# EAGLE design audioProto_v1 (EAGLE 9.4.2)
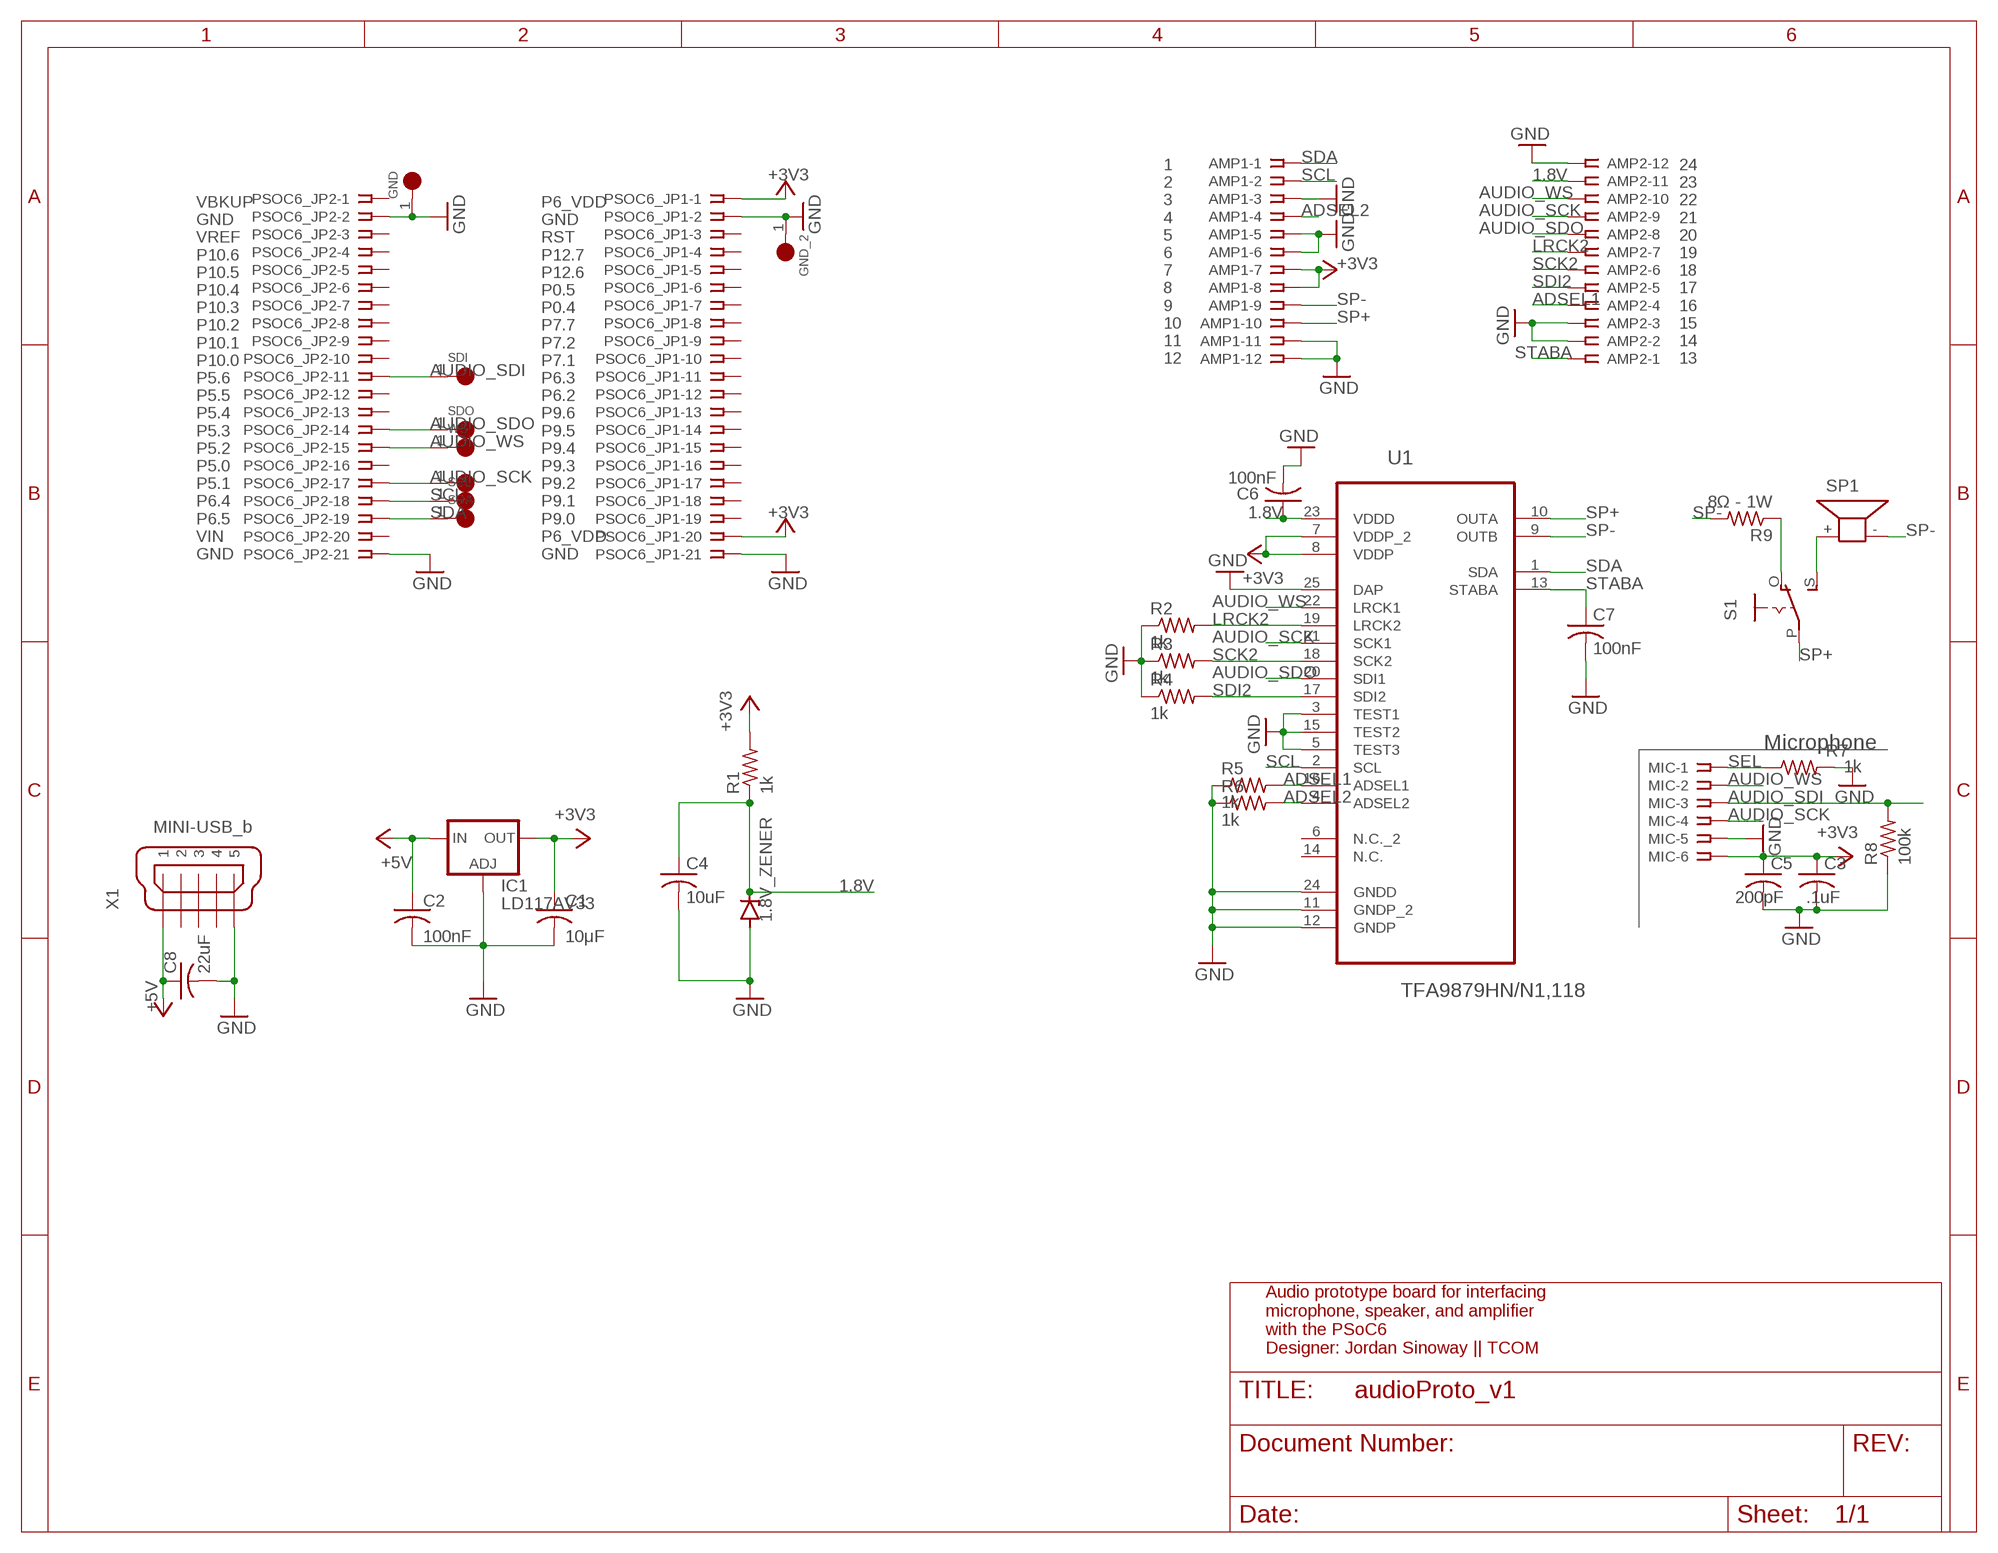
[diagram p0: schematic, sheet 1]

## Parts
1.8V_ZENER  BZV10  [DO34Z7]
AMP1  SSW-112-02-G-S  [SSW-112-02-G-S]
AMP2  SSW-112-02-G-S  [SSW-112-02-G-S]
C1  10μF  C-US050-024X044  [C050-024X044]
C2  100nF  C-US050-024X044  [C050-024X044]
C3  .1uF  C-US050-024X044  [C050-024X044]
C4  10uF  C-US050-024X044  [C050-024X044]
C5  200pF  C-US050-024X044  [C050-024X044]
C6  100nF  C-US050-024X044  [C050-024X044]
C7  100nF  C-US050-024X044  [C050-024X044]
C8  22uF  C-US050-024X044  [C050-024X044]
GND  5013  [TESTPOINT_5013]
GND_2  5013  [TESTPOINT_5013]
IC1  LD117AV33  [TO220L1]
MIC  SSW-106-02-G-S  [SSW-106-02-G-S]
PSOC6_JP1  SSW-121-02-G-S  [SSW-121-02-G-S]
PSOC6_JP2  SSW-121-02-G-S  [SSW-121-02-G-S]
R1  1k  R-US_0204/7  [0204/7]
R2  1k  R-US_0204/7  [0204/7]
R3  1k  R-US_0204/7  [0204/7]
R4  1k  R-US_0204/7  [0204/7]
R5  1k  R-US_0204/7  [0204/7]
R6  1k  R-US_0204/7  [0204/7]
R7  1k  R-US_0207/9  [0207/9]
R8  100k  R-US_0207/9  [0207/9]
R9  8Ω - 1W  R-US_0207/10  [0207/10]
S1  EG1218S  [EG1218]
SCK  5013  [TESTPOINT_5013]
SCL  5013  [TESTPOINT_5013]
SDA  5013  [TESTPOINT_5013]
SDI  5013  [TESTPOINT_5013]
SDO  5013  [TESTPOINT_5013]
SP1  KSS1201  [KSS1201]
U1  TFA9879HN/N1,118  [QFN50P260X260X100-25N]
WS  5013  [TESTPOINT_5013]
X1  MINI-USB_b  MINI-USB_SHIELD5P2-32005-601  [32005-601]

## Nets
1.8V: 1.8V_ZENER.C AMP2.11 C4.1 C6.1 R1.1 U1.23(VDDD)
+3V3: AMP1.7 AMP1.8 C1.1 C3.1 C5.1 IC1.2(OUT) MIC.6 PSOC6_JP1.1 PSOC6_JP1.20 R1.2 U1.7(VDDP_2) U1.8(VDDP)
+5V [GND/voltage]: C2.1 C8.1 IC1.3(IN) X1.1
ADSEL1: AMP2.4 R5.2 U1.16(ADSEL1)
ADSEL2: AMP1.4 R6.2 U1.4(ADSEL2)
AUDIO_SCK: AMP2.9 MIC.4 PSOC6_JP2.17 SCK.1(TP) U1.21(SCK1)
AUDIO_SDI: MIC.3 PSOC6_JP2.11 R8.2 SDI.1(TP)
AUDIO_SDO: AMP2.8 PSOC6_JP2.14 SDO.1(TP) U1.20(SDI1)
AUDIO_WS: AMP2.10 MIC.2 PSOC6_JP2.15 U1.22(LRCK1) WS.1(TP)
GND: 1.8V_ZENER.A AMP1.3 AMP1.5 AMP1.6 AMP1.11 AMP1.12 AMP2.2 AMP2.3 AMP2.12 C1.2 C2.2 C3.2 C4.2 C5.2 C6.2 C7.2 C8.2 GND.1(TP) GND_2.1(TP) IC1.1(ADJ) MIC.5 PSOC6_JP1.2 PSOC6_JP1.21 PSOC6_JP2.2 PSOC6_JP2.21 R2.1 R3.1 R4.1 R5.1 R6.1 R7.2 R8.1 U1.3(TEST1) U1.5(TEST3) U1.11(GNDP_2) U1.12(GNDP) U1.15(TEST2) U1.24(GNDD) U1.25(DAP) X1.5
LRCK2: AMP2.7 R2.2 U1.19(LRCK2)
N$1: R9.1 S1.O
N$2: S1.S SP1.+
SCK2: AMP2.6 R3.2 U1.18(SCK2)
SCL: AMP1.2 PSOC6_JP2.18 SCL.1(TP) U1.2(SCL)
SDA: AMP1.1 PSOC6_JP2.19 SDA.1(TP) U1.1(SDA)
SDI2: AMP2.5 R4.2 U1.17(SDI2)
SEL: MIC.1 R7.1
SP+: AMP1.10 S1.P U1.10(OUTA)
SP-: AMP1.9 R9.2 SP1.- U1.9(OUTB)
STABA: AMP2.1 C7.1 U1.13(STABA)
Unconnected: PSOC6_JP1.3 PSOC6_JP1.4 PSOC6_JP1.5 PSOC6_JP1.6 PSOC6_JP1.7 PSOC6_JP1.8 PSOC6_JP1.9 PSOC6_JP1.10 PSOC6_JP1.11 PSOC6_JP1.12 PSOC6_JP1.13 PSOC6_JP1.14 PSOC6_JP1.15 PSOC6_JP1.16 PSOC6_JP1.17 PSOC6_JP1.18 PSOC6_JP1.19 PSOC6_JP2.1 PSOC6_JP2.3 PSOC6_JP2.4 PSOC6_JP2.5 PSOC6_JP2.6 PSOC6_JP2.7 PSOC6_JP2.8 PSOC6_JP2.9 PSOC6_JP2.10 PSOC6_JP2.12 PSOC6_JP2.13 PSOC6_JP2.16 PSOC6_JP2.20 U1.6(N.C._2) U1.14(N.C.) X1.2 X1.3 X1.4 X1.M1(S1) X1.M2(S2)

## Notes on the sheet
- 1
  2
  3
  4
  5
  6
  7
  8
  9
  10
  11
  12
- 24
  23
  22
  21
  20
  19
  18
  17
  16
  15
  14
  13
- VBKUP
  GND
  VREF
  P10.6
  P10.5
  P10.4
  P10.3
  P10.2
  P10.1
  P10.0
  P5.6
  P5.5
  P5.4
  P5.3
  P5.2
  P5.0
  P5.1
  P6.4
  P6.5
  VIN
  GND
- P6_VDD
  GND
  RST
  P12.7
  P12.6
  P0.5
  P0.4
  P7.7
  P7.2
  P7.1
  P6.3
  P6.2
  P9.6
  P9.5
  P9.4
  P9.3
  P9.2
  P9.1
  P9.0
  P6_VDD
  GND
- Microphone
- Audio prototype board for interfacing
  microphone, speaker, and amplifier 
  with the PSoC6 
  Designer: Jordan Sinoway || TCOM

## Library data of the parts
1.8V_ZENER = diode:BZV10: Z DIODE
AMP1 AMP2 = con-samtec:SSW-112-02-G-S: THROUGH-HOLE .025" SQ POST SOCKET Source: Samtec SSW.pdf; MF: Samtec Inc.; MPN: SSW-112-02-G-S; OC_FARNELL: unknown; OC_NEWARK: 11P9515
C1-C8 = adafruit:C-US: CAPACITOR, American symbol
GND GND_2 SCK SCL SDA SDI SDO WS = 5013:5013: Test Point; Orange; Thru-Hole; Snap-Fit; SilverPlate; 0.063in. Dia.; 0.445In.; AVAILABILITY: Unavailable; DESCRIPTION: Test Point; Orange; Thru-Hole; Snap-Fit; SilverPlate; 0.063in. Dia.; 0.445In.; MF: Keystone Electronics; MP: 5013; PACKAGE: TO-5 Keystone; PRICE: None
IC1 = v-reg:LD117A?*: Low drop fixed and adjustable positive voltage regulators 1 A Source: http://www.st.com/stonline/products/literature/ds/7194/ld1117axx.pdf
MIC = con-samtec:SSW-106-02-G-S: THROUGH-HOLE .025" SQ POST SOCKET Source: Samtec SSW.pdf; MF: Samtec Inc.; MPN: SSW-106-02-G-S; OC_FARNELL: unknown; OC_NEWARK: 11P9416
PSOC6_JP1 PSOC6_JP2 = con-samtec:SSW-121-02-G-S: THROUGH-HOLE .025" SQ POST SOCKET Source: Samtec SSW.pdf; MF: Samtec Inc.; MPN: SSW-121-02-G-S; OC_FARNELL: unknown; OC_NEWARK: 11P9658
R1-R9 = adafruit:R-US_: RESISTOR, American symbol
S1 = adafruit:EG1218: SLIDING SWITCH 0.1" spacing through hole, vertical SPDT slide switch http://www.ladyada.net/library/pcb/eaglelibrary.html
SP1 = buzzer:KSS1201: SPEAKER Source: Schukat; OC_FARNELL: unknown; OC_NEWARK: unknown
U1 = TFA9879HN_N1_118:TFA9879HN/N1,118: Mono BTL class-D audio amplifier for portable applications with digital input; AVAILABILITY: Unavailable; DESCRIPTION: Audio Amp Speaker 1-CH Mono 2.75W Class-D 24-Pin HVQFN EP T/R; MF: NXP USA; MP: TFA9879HN/N1,118; PACKAGE: HVQFN-24 NXP Semiconductors; PRICE: None
X1 = con-cypressindustries:MINI-USB_SHIELD5P2-: MINI USB-B R/A DIP 5pol. Source: www.cypressindustries.com; OC_FARNELL: unknown; OC_NEWARK: unknown

## Net classes
0 default: clearance 0.102 mm
1 GND/voltage: width 0.457 mm, drill 0.152 mm, clearance 0.152 mm

## Board
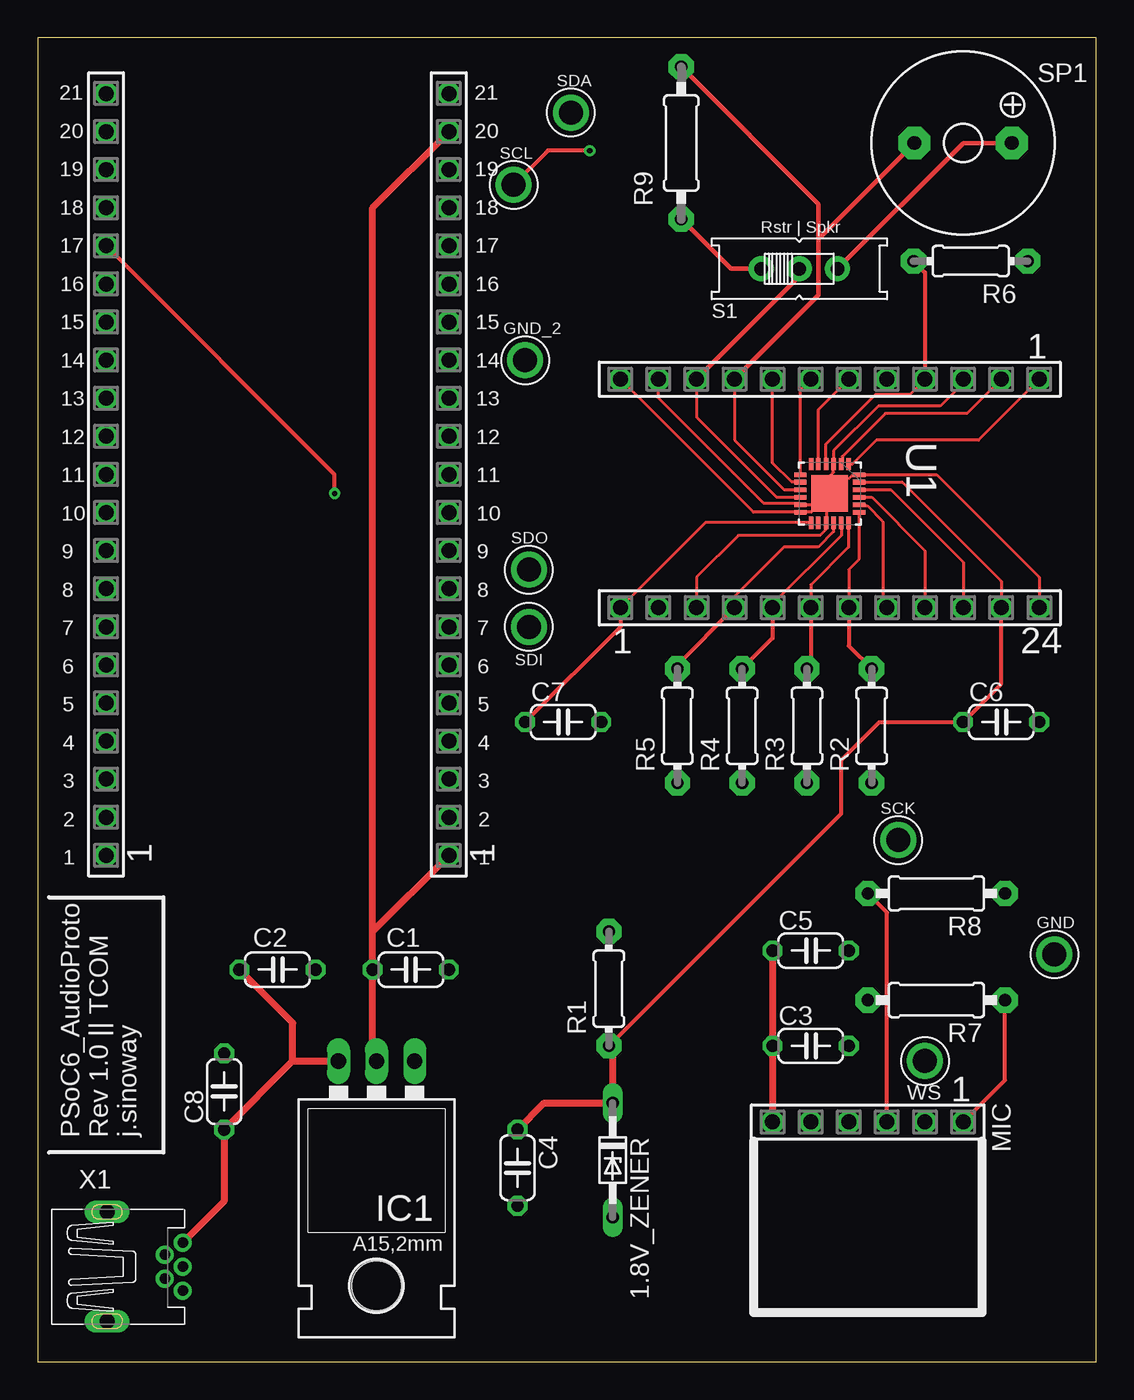
[diagram p1: board, top side]
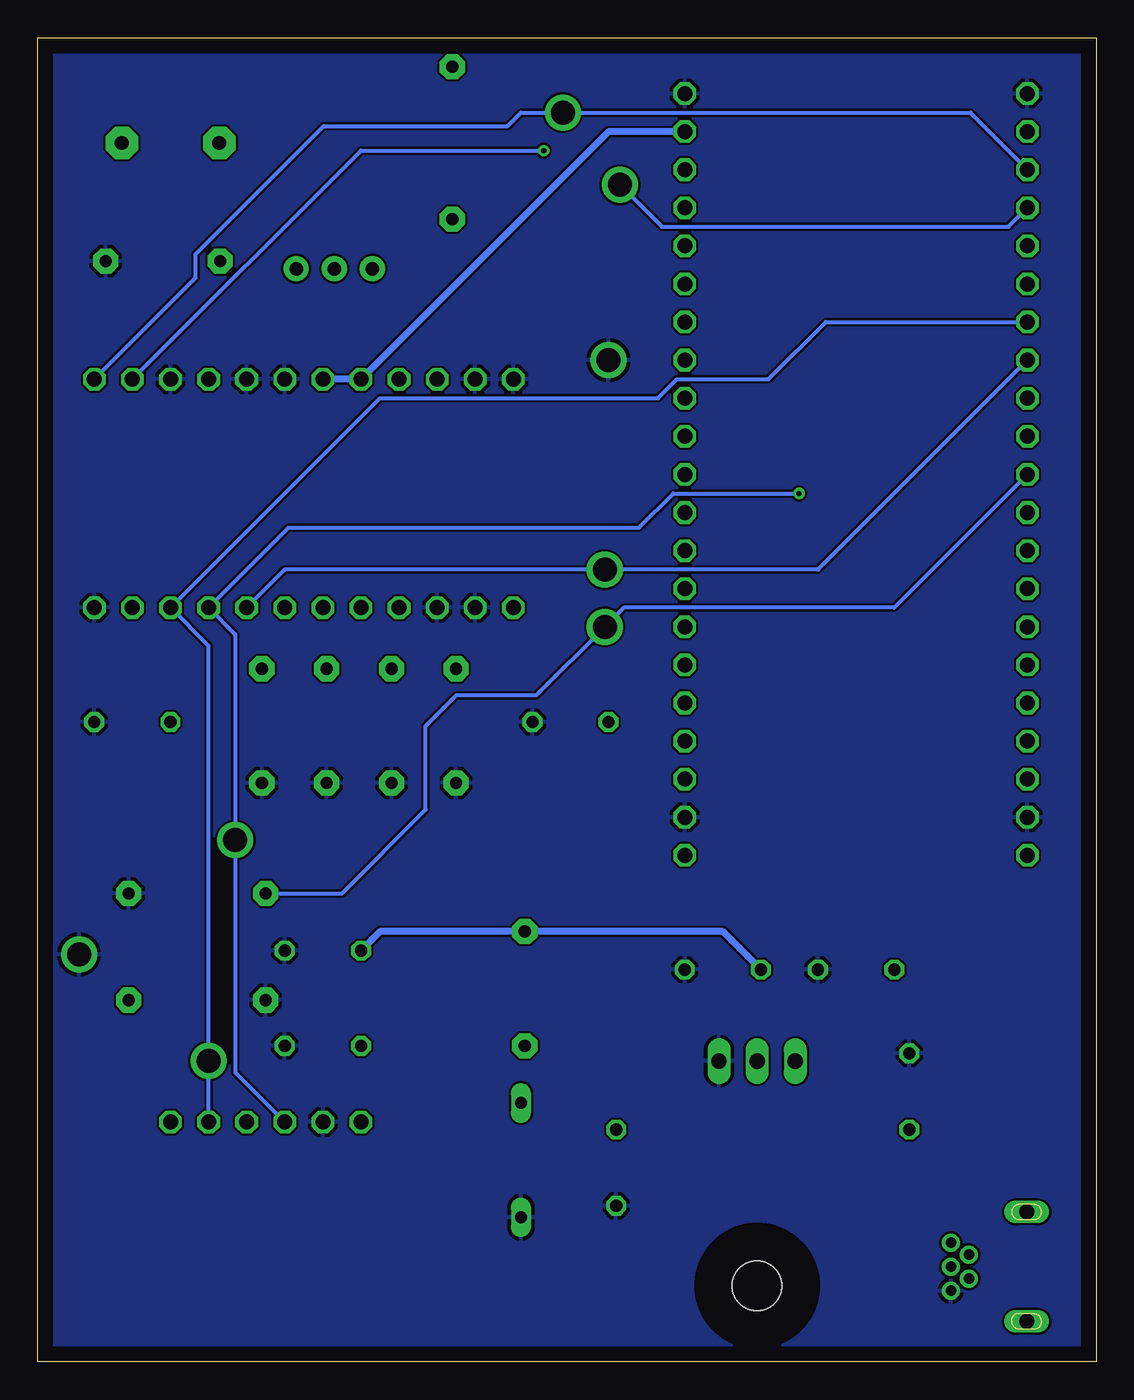
[diagram p2: board, bottom side, seen from below]

Size 70.59 x 88.32 mm. Coordinates in mm from the lower left corner, seen from the top.
Outline: 0,0 70.59,0 70.59,88.32 0,88.32 0,0
Copper layers (1*16): Top 0.035mm / dielectric 1.5mm / Bottom 0.035mm
Design rules "default": minimum track width 6mil, minimum drill 0.35mm, track to track 6mil, track to pad 6mil, pad to pad 6mil, via to via 6mil, smd to smd 6mil, copper to edge 40mil, drill to drill 6mil, minimum pad ring 10mil, minimum via ring 8mil, stop-mask expansion 4mil, vias tented up to drill 0mil, thermal gap 10mil

### Footprints (pad centres in the part's own frame; a part is rotated, then mirrored left to right if it is on the bottom)
DO34Z7 = drill 0.813 long: A 3.81,0; C -3.81,0
SSW-112-02-G-S = drill 1 pad 1.5 octagon: 1 -13.97,0; 2 -11.43,0; 3 -8.89,0; 4 -6.35,0; 5 -3.81,0; 6 -1.27,0; 7 1.27,0; 8 3.81,0; 9 6.35,0; 10 8.89,0; 11 11.43,0; 12 13.97,0
C050-024X044 = drill 0.813 octagon: 1 -2.54,0; 2 2.54,0
TESTPOINT_5013 = drill 1.6: 1 0,0
TO220L1 = drill 1.016 long: 1 -2.54,-3.81; 2 0,-3.81; 3 2.54,-3.81 | hole 3.302: 0,11.176
SSW-106-02-G-S = drill 1 pad 1.5 octagon: 1 -6.35,0; 2 -3.81,0; 3 -1.27,0; 4 1.27,0; 5 3.81,0; 6 6.35,0
SSW-121-02-G-S = drill 1 pad 1.5 octagon: 1 -25.4,0; 2 -22.86,0; 3 -20.32,0; 4 -17.78,0; 5 -15.24,0; 6 -12.7,0; 7 -10.16,0; 8 -7.62,0; 9 -5.08,0; 10 -2.54,0; 11 0,0; 12 2.54,0; 13 5.08,0; 14 7.62,0; 15 10.16,0; 16 12.7,0; 17 15.24,0; 18 17.78,0; 19 20.32,0; 20 22.86,0; 21 25.4,0
0204/7 = drill 0.813 pad 1.676 octagon: 1 -3.81,0; 2 3.81,0
0207/9 = drill 0.813 pad 1.676 octagon: 1 -4.572,0; 2 4.572,0
0207/10 = drill 0.813 pad 1.676 octagon: 1 -5.08,0; 2 5.08,0
EG1218 = drill 0.9 pad 1.676: O -2.54,0; P 0,0; S 2.54,0
KSS1201 = drill 0.914 pad 2.159 octagon: + 3.251,0; - -3.251,0
QFN50P260X260X100-25N = smd 0.813 x 0.305: 1 -1.956,1.245; 2 -1.956,0.762; 3 -1.956,0.254; 4 -1.956,-0.254; 5 -1.956,-0.762; 6 -1.956,-1.245; 13 1.956,-1.245; 14 1.956,-0.762; 15 1.956,-0.254; 16 1.956,0.254; 17 1.956,0.762; 18 1.956,1.245 | smd 0.305 x 0.813: 7 -1.245,-1.956; 8 -0.762,-1.956; 9 -0.254,-1.956; 10 0.254,-1.956; 11 0.762,-1.956; 12 1.245,-1.956; 19 1.245,1.956; 20 0.762,1.956; 21 0.254,1.956; 22 -0.254,1.956; 23 -0.762,1.956; 24 -1.245,1.956 | smd 2.438 x 2.438: 25 0,0
32005-601 = drill 0.7 pad 1.016: 1 2.825,1.6; 2 1.625,0.8; 3 2.825,0; 4 1.625,-0.8; 5 2.825,-1.6 | drill 1 pad 1.422 long: M1 -2.225,3.65; M2 -2.225,-3.65

### Placement (x,y rotation side)
1.8V_ZENER  38.35,13.46 270 top
AMP1  52.83,65.53 180 top
AMP2  52.83,50.29 0 top
C1  24.89,26.16 0 top
C2  16,26.16 0 top
C3  51.56,21.08 0 top
C4  32,12.95 270 top
C5  51.56,27.43 0 top
C6  64.26,42.67 0 top
C7  35.05,42.67 0 top
C8  12.45,18.03 90 top
GND  67.82,27.18 0 top
GND_2  32.51,66.8 0 top
IC1  22.61,16.26 180 top
MIC  55.37,16 180 top
PSOC6_JP1  27.43,59.18 90 top
PSOC6_JP2  4.57,59.18 90 top
R1  38.1,24.89 90 top
R2  55.63,42.42 90 top
R3  51.31,42.42 90 top
R4  46.99,42.42 90 top
R5  42.67,42.42 90 top
R6  62.23,73.41 180 top
R7  59.94,24.13 180 top
R8  59.94,31.24 180 top
R9  42.93,81.28 90 top
S1  50.8,72.9 0 top
SCK  57.4,34.8 0 top
SCL  31.75,78.49 0 top
SDA  35.56,83.31 0 top
SDI  32.77,49.02 0 top
SDO  32.77,52.83 0 top
SP1  61.72,81.28 0 top
U1  52.83,57.91 270 top
WS  59.18,20.07 0 top
X1  6.86,6.35 0 top

### Tracks (layer width: path | path; a pad name or v marks a point on that pad's centre or on a via)
1.8V
  Top 0.203: U1.23 57.66,58.67 64.26,52.07 64.26,50.55 AMP2.11
  Top 0.254: R1.1 53.59,36.58 53.59,40.13 56.13,42.67 C6.1 64.26,45.21 64.26,50.55
  Top 0.457: R1.1 38.35,20.83 1.8V_ZENER.C 33.78,17.27 C4.1
+3V3
  Top 0.203: U1.7 50.88,64.85 AMP1.7 | U1.8 50.29,58.67 49.02,59.94 AMP1.8
  Top 0.457: IC1.2 22.35,20.32 C1.1 22.35,28.7 | 22.35,28.7 PSOC6_JP1.1 | 22.35,28.7 22.35,76.96 PSOC6_JP1.20 | C5.1 C3.1 MIC.6
  Bottom 0.457: PSOC6_JP1.20 32.51,82.04 AMP1.8 AMP1.7 | C1.1 24.89,28.7 R1.2 47.75,28.7 C5.1
+5V
  Top 0.457: 17.02,20.07 C8.1 12.45,10.71 X1.1 | 17.02,20.07 IC1.3 | 17.02,20.07 17.02,22.61 C2.1
ADSEL1
  Top 0.203: U1.16 53.09,55.37 52.07,54.36 49.78,54.36 46.48,51.05 AMP2.4
  Top 0.254: R5.2 42.67,46.48 AMP2.4
ADSEL2
  Top 0.203: U1.4 52.58,61.21 55.88,64.52 58.17,64.52 AMP1.4
  Top 0.254: R6.2 59.18,72.64 AMP1.4
AUDIO_SCK  (via drill 0.35)
  Top 0.203: U1.21 55.63,57.66 59.18,54.1 AMP2.9
  Top 0.254: v19.81,57.91 19.81,59.18 PSOC6_JP2.17
  Bottom 0.254: v19.81,57.91 28.19,57.91 30.48,55.63 53.85,55.63 AMP2.9 57.4,48.51 SCK.1 57.4,19.3 MIC.4
AUDIO_SDI
  Top 0.254: MIC.3 56.64,29.97 R8.2
  Bottom 0.254: PSOC6_JP2.11 13.46,50.29 31.5,50.29 SDI.1 37.34,44.45 42.67,44.45 44.7,42.42 44.7,36.83 50.29,31.24 R8.2
AUDIO_SDO
  Top 0.203: U1.20 54.84,57.1 55.33,57.1 56.39,56.04 56.39,50.55 AMP2.8
  Bottom 0.254: AMP2.8 54.1,52.83 SDO.1 18.54,52.83 PSOC6_JP2.14
AUDIO_WS
  Top 0.203: U1.22 56.9,58.17 61.72,53.34 AMP2.10
  Bottom 0.254: PSOC6_JP2.15 18.03,69.34 21.84,65.53 27.94,65.53 29.21,64.26 47.75,64.26 AMP2.10 59.18,47.75 WS.1 MIC.2
GND
  Top 0.203: AMP1.11 41.4,64.28 48.43,57.25 50.77,57.25 U1.11 52.07,57.15 51.59,56.67 U1.12 47.73,56.67 AMP1.12 | AMP1.3 61.72,65.28 60.2,63.75 56.07,63.75 53.09,60.77 U1.3 53.08,59.86 53.08,59.33 52.86,59.11 52.86,57.94 U1.25 52.61,57.69 52.61,55.99 U1.15 52.58,55.51 52.19,55.12 46.74,55.12 43.94,52.32 AMP2.3 | 54.12,58.93 54.28,59.08 54.71,59.08 U1.24 59.97,59.16 66.8,52.32 AMP2.12 | AMP1.6 52.07,63.5 U1.5
  pour Bottom: 1.02,87.38 70.1,87.38 70.1,0.76 1.02,0.76
LRCK2
  Top 0.203: U1.19 54.79,53.52 54.1,52.83 AMP2.7
  Top 0.254: AMP2.7 54.1,47.75 R2.2
N$1
  Top 0.305: S1.O 46.23,72.9 R9.1
N$2
  Top 0.305: S1.S 61.72,81.28 SP1.+
SCK2
  Top 0.203: U1.18 54.08,54.33 51.56,51.82 AMP2.6
  Top 0.254: AMP2.6 51.56,46.48 R3.2
SCL  (via drill 0.35)
  Top 0.203: AMP1.2 61.98,63.25 56.54,63.25 53.67,60.38 53.67,59.94 U1.2
  Top 0.254: v36.83,80.77 34.04,80.77 SCL.1
  Bottom 0.254: AMP1.2 49.02,80.77 v36.83,80.77 | PSOC6_JP2.18 5.84,75.69 28.96,75.69 SCL.1
SDA
  Top 0.203: AMP1.1 62.74,61.47 55.93,61.47 54.33,59.87 U1.1
  Bottom 0.254: AMP1.1 60.05,72.29 60.05,73.87 51.5,82.41 39.26,82.41 38.35,83.31 SDA.1 8.38,83.31 PSOC6_JP2.19
SDI2
  Top 0.203: U1.17 53.59,55.12 49.02,50.55 AMP2.5
  Top 0.254: AMP2.5 49.02,48.26 R4.2
SEL
  Top 0.254: MIC.1 64.52,18.8 R7.1
SP+
  Top 0.203: AMP1.10 43.94,63 49.29,57.66 U1.10
  Top 0.305: AMP1.10 50.8,72.39 S1.P
SP-
  Top 0.203: AMP1.9 46.48,61.47 49.79,58.17 U1.9
  Top 0.305: AMP1.9 52.07,71.12 52.07,74.88 | SP1.- 52.07,74.88 | 52.07,74.88 52.07,77.22 R9.2
STABA
  Top 0.203: U1.13 44.53,55.96 AMP2.1
  Top 0.254: AMP2.1 38.86,49.02 C7.1

### Text on the board
tPlace: Rstr | Spkr
tNames: 24 | 21 / 20 / 19 / 18 / 17 / 16 / 15 / 14 / 13 / 12 / 11 / 10 / 9 / 8 / 7 / 6 / 5 / 4 / 3 / 2 / 1 | 21 / 20 / 19 / 18 / 17 / 16 / 15 / 14 / 13 / 12 / 11 / 10 / 9 / 8 / 7 / 6 / 5 / 4 / 3 / 2 / 1 | PSoC6_AudioProto / Rev 1.0 || TCOM / j.sinoway